# EAGLE design Left_Bar (EAGLE 9.1.1)
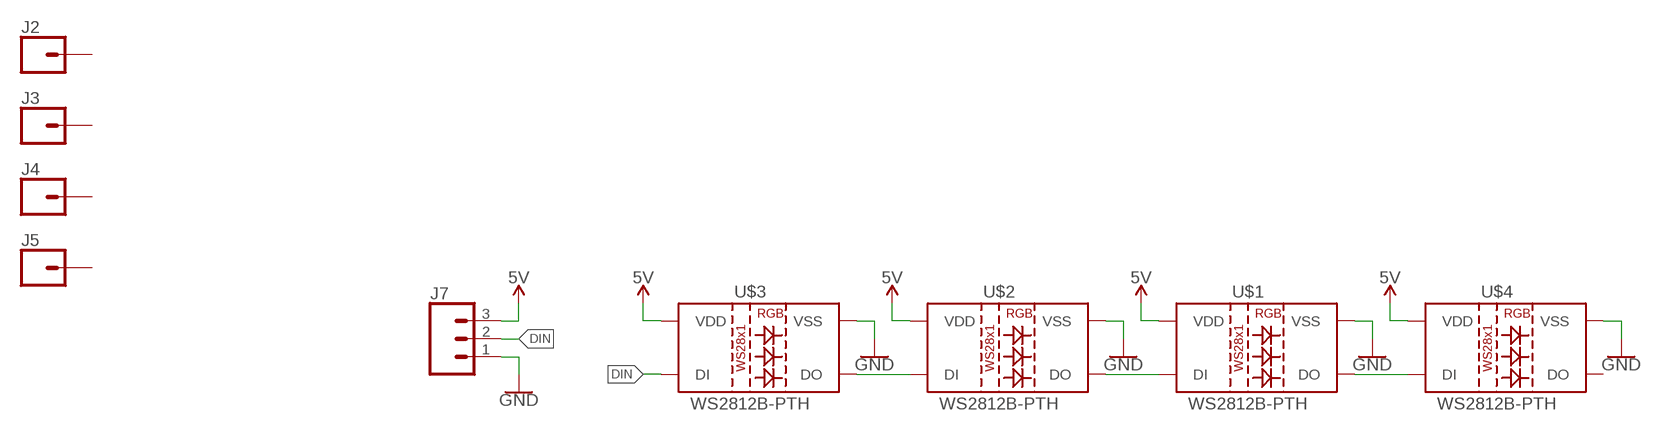
[diagram p0: schematic, sheet 1]

## Parts
J2  CONN_01OFFSET  [1X01_OFFSET]
J3  CONN_01OFFSET  [1X01_OFFSET]
J4  CONN_01OFFSET  [1X01_OFFSET]
J5  CONN_01OFFSET  [1X01_OFFSET]
J7  CONN_03  [1X03]
U$1  WS2812B-PTH  [WS2812B-PTH-KIT]
U$2  WS2812B-PTH  [WS2812B-PTH-KIT]
U$3  WS2812B-PTH  [WS2812B-PTH-KIT]
U$4  WS2812B-PTH  [WS2812B-PTH-KIT]

## Nets
5V: J7.3 U$1.2(VDD) U$2.2(VDD) U$3.2(VDD) U$4.2(VDD)
DIN: J7.2 U$3.1(DI)
GND: J7.1 U$1.3(VSS) U$2.3(VSS) U$3.3(VSS) U$4.3(VSS)
N$1: U$1.4(DO) U$4.1(DI)
N$7: U$2.1(DI) U$3.4(DO)
N$8: U$1.1(DI) U$2.4(DO)
Unconnected: J2.1 J3.1 J4.1 J5.1 U$4.4(DO)

## Library data of the parts
J2-J5 = SparkFun-Connectors:CONN_01: Single connection point. Often used as Generic Header-pin footprint for 0.1 inch spaced/style header connections On any of the 0.1 inch spaced packages, you can populate with these: Break Away Headers - Straight <https://www.sparkfun.com/products/116> (PRT-00116) Break Away Male Headers - Right Angle <https://www.sparkfun.com/products/553> (PRT-00553) Female Headers <https://www.sparkfun.com/products/115> (PRT-00115) Break Away Headers - Machine Pin <https://www.sparkfun.com/products/117> (PRT-00117) Break Away Female Headers - Swiss Machine Pin <https://www.sparkfun.com/products/743> (PRT-00743) This device is also useful as a general connection point to wire up your design to another part of your project. Our various solder wires solder well into these plated through hole pads. Hook-Up Wire - Assortment (Stranded, 22 AWG) <https://www.sparkfun.com/products/11375> (PRT-11375) Hook-Up Wire - Assortment (Solid Core, 22 AWG) <https://www.sparkfun.com/products/11367> (PRT-11367) View the entire wire category on our website here <https://www.sparkfun.com/categories/141> Special notes: SMTSO-256-ET is a "flush mount" nut for a 4-40 screw. We mostly use this on specialty testbeds; it is a nice way to connect hardware to your PCB at an adjustable hieght. Also note, the SNAP packages are for using a snappable style connector. We sell a baggie of snaps and they are also used on two LilyPad designs: Snap Assortment - 30 pack (male and female) <https://www.sparkfun.com/products/11347> (DEV-11347) LilyPad Arduino SimpleSnap <https://www.sparkfun.com/products/10941> (DEV-10941) LilyPad SimpleSnap Protoboard <https://www.sparkfun.com/products/10940> (DEV-10940)
J7 = SparkFun-Connectors:CONN_03: Multi connection point. Often used as Generic Header-pin footprint for 0.1 inch spaced/style header connections On any of the 0.1 inch spaced packages, you can populate with these: Break Away Headers - Straight <https://www.sparkfun.com/products/116> (PRT-00116) Break Away Male Headers - Right Angle <https://www.sparkfun.com/products/553> (PRT-00553) Female Headers <https://www.sparkfun.com/products/115> (PRT-00115) Break Away Headers - Machine Pin <https://www.sparkfun.com/products/117> (PRT-00117) Break Away Female Headers - Swiss Machine Pin <https://www.sparkfun.com/products/743> (PRT-00743) Stackable Header - 3 Pin (Female, 0.1") <https://www.sparkfun.com/products/13875> (PRT-13875) For SCREWTERMINALS and SPRING TERMINALS visit here: Screw Terimnals on SparkFun.com <https://www.sparkfun.com/search/results?term=Screw+Terminals> (5mm/3.5mm/2.54mm spacing) This device is also useful as a general connection point to wire up your design to another part of your project. Our various solder wires solder well into these plated through hole pads. Hook-Up Wire - Assortment (Stranded, 22 AWG) <https://www.sparkfun.com/products/11375> (PRT-11375) Hook-Up Wire - Assortment (Solid Core, 22 AWG) <https://www.sparkfun.com/products/11367> (PRT-11367) View the entire wire category on our website here <https://www.sparkfun.com/categories/141> Special notes: Molex polarized connector foot print use with SKU : PRT-08232 with associated crimp pins and housings.; PROD_ID: XXX-00000; VALUE: 455-1750-1-ND
U$1-U$4 = SparkFun-LED:WS2812B-PTH: WS2812B PTH addressable RGB LED 5mm PTH LED with built-in controller IC. Color: Red/Green/Blue mC Rating: RGB: 390, 660, 180 mcd Forward Voltage: RGB: 2.0, 3.0, 3.0 V SparkFun Products: LED - RGB Addressable, PTH, 5mm Diffused (5 Pack) <https://www.sparkfun.com/products/12986> LED - RGB Addressable, PTH, 5mm Clear (5 Pack) <https://www.sparkfun.com/products/12999> Datasheet referenced for footprint: WS2812B-PTH <https://cdn.sparkfun.com/datasheets/Components/LED/COM-12877.pdf>

## Board
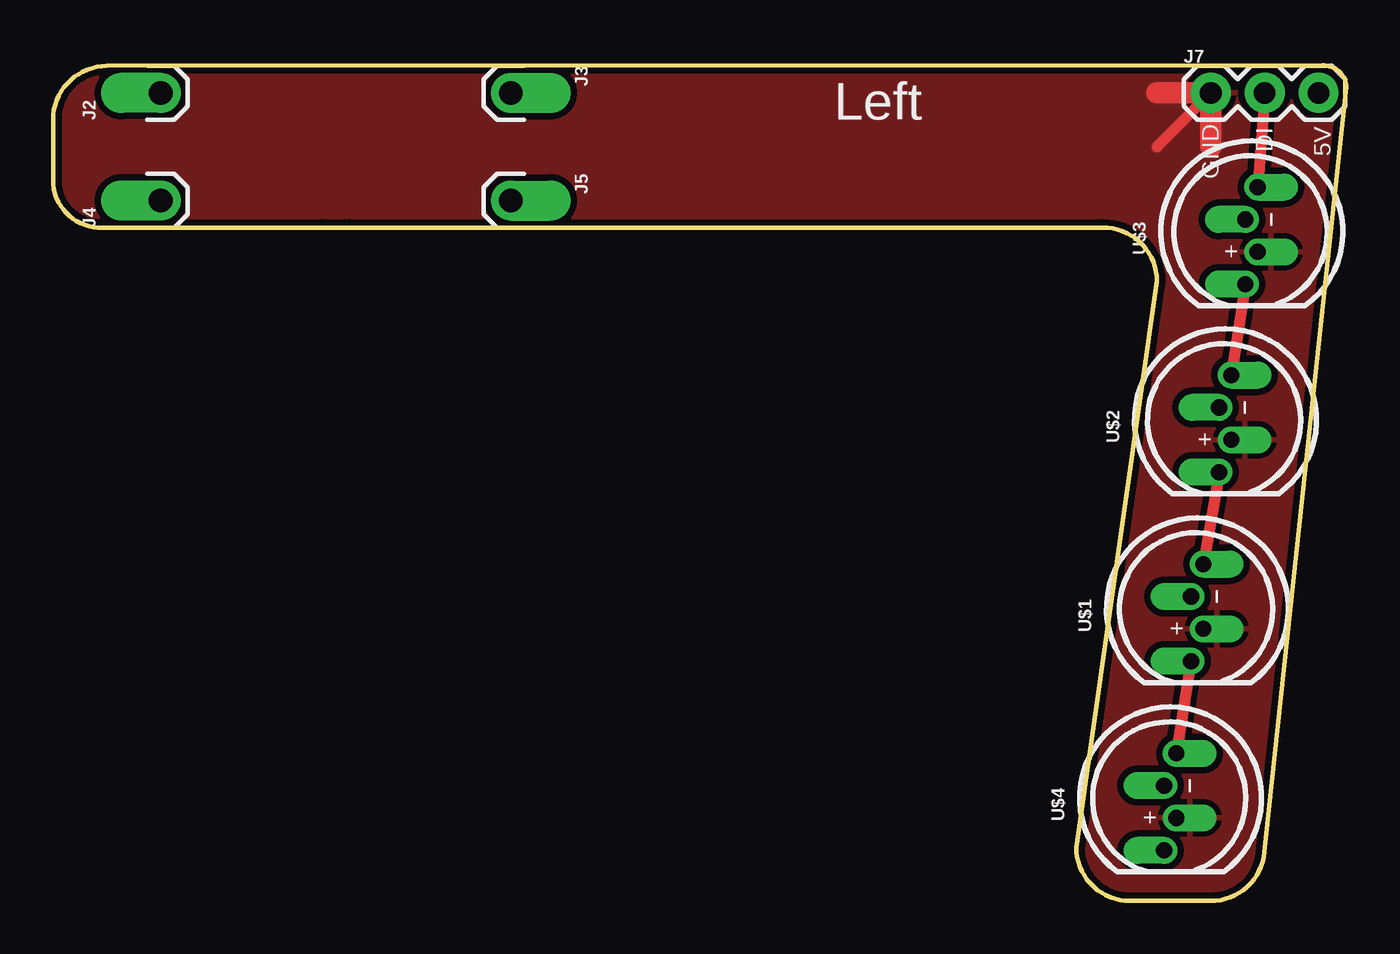
[diagram p1: board, top side]
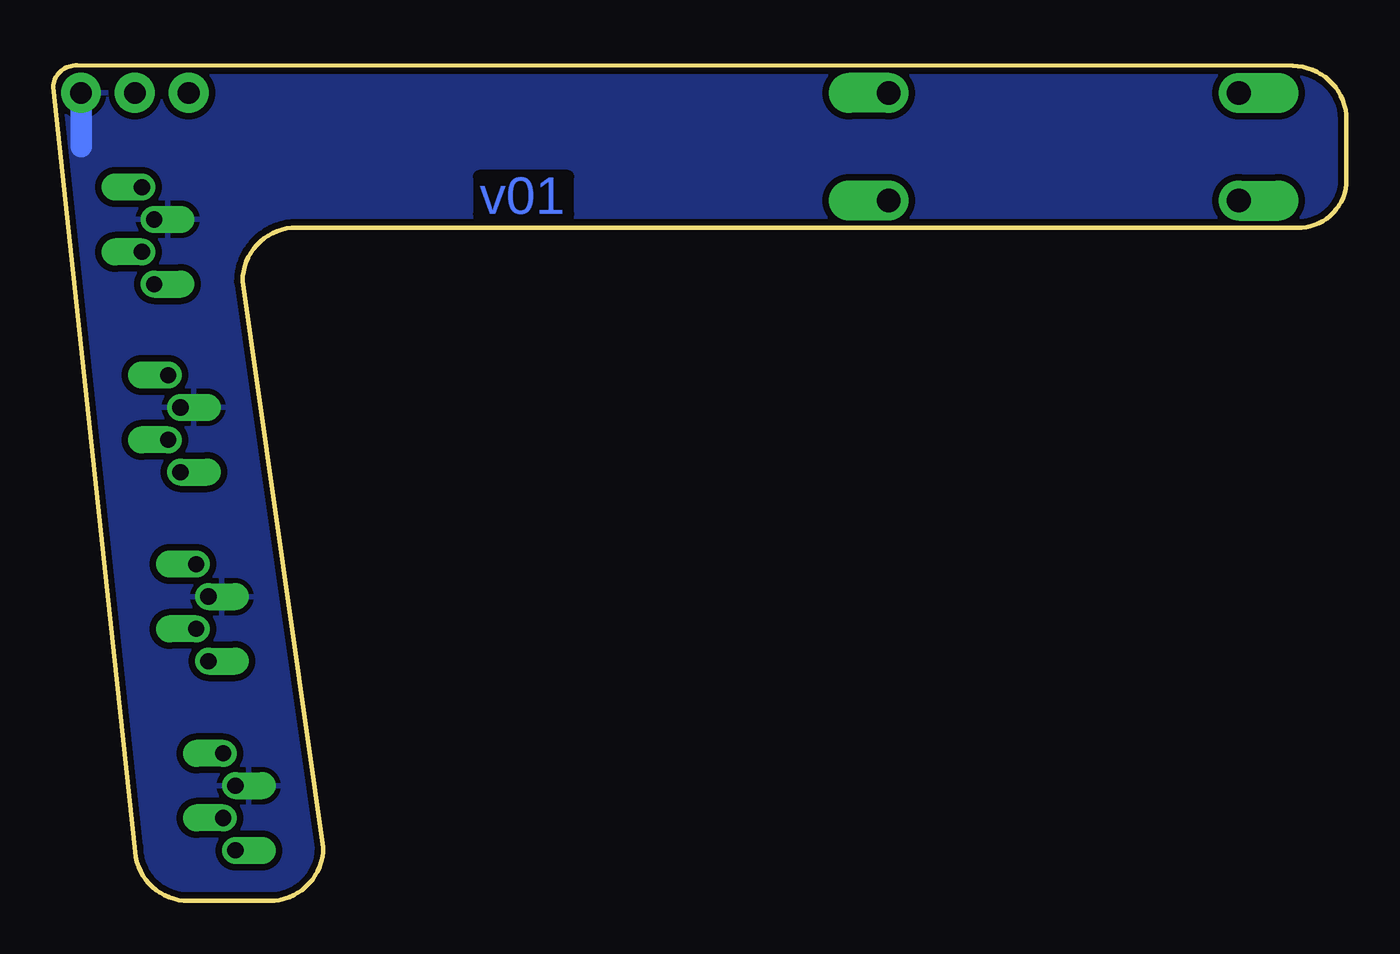
[diagram p2: board, bottom side, seen from below]

Size 61.01 x 39.4 mm. Coordinates in mm from the lower left corner, seen from the top.
Outline: 0,36.83 0,33.78 arc90 2.54,31.75 12.7,31.75 13.97,31.75 49.53,31.75 arc-90 52.07,29.21 48.26,2.54 arc90 50.8,0 54.61,0 arc90 57.15,2.54 61.01,38.35 arc90 59.87,39.4 2.54,39.37 arc90 0,36.83
Copper layers (1*16): Top 0.035mm / dielectric 1.5mm / Bottom 0.035mm
Design rules "SparkFun-2-layer-STANDARD": minimum track width 10mil, minimum drill 20mil, track to track 10mil, track to pad 8mil, pad to pad 8mil, via to via 10mil, smd to smd 8mil, copper to edge 8mil, drill to drill 8mil, minimum pad ring 10mil, minimum via ring 10mil, stop-mask expansion 4mil, vias tented up to drill 25mil, thermal gap 10mil

### Footprints (pad centres in the part's own frame; a part is rotated, then mirrored left to right if it is on the bottom)
1X01_OFFSET = drill 1.118 pad 1.88 offset: 1 0,0
1X03 = drill 1.016 pad 1.88: 1 0,0; 2 2.54,0; 3 5.08,0
WS2812B-PTH-KIT = drill 0.762 pad 1.27 offset: 1 2.413,0.079; 2 0.889,0.651; 3 -0.635,0.079; 4 -2.159,0.651

### Placement (x,y rotation side)
J2  5.08,38.1 90 top
J3  21.59,38.1 270 top
J4  5.08,33.02 90 top
J5  21.59,33.02 270 top
J7  54.61,38.1 0 top
U$1  54.33,13.46 90 top
U$2  55.65,22.38 90 top
U$3  56.9,31.24 90 top
U$4  53.06,4.55 90 top

### Tracks (layer width: path | path; a pad name or v marks a point on that pad's centre or on a via)
5V
  Bottom 1.016: J7.3 59.69,35.56
  pour Bottom (isolate 0.305): 0,0 0,39.37 60.96,39.37 60.96,0
DIN
  Top 0.508: J7.2 U$3.1
GND  (via drill 0.51)
  Top 0.508: J7.1 52.07,35.56
  Top 1.016: 54.61,35.56 J7.1 52.07,38.1
  other vias: 54.61,38.1
  pour Top (isolate 0.305): 0,0 60.96,0 60.96,39.37 0,39.37
N$1
  Top 0.508: U$1.4 U$4.1
N$7
  Top 0.508: U$3.4 U$2.1
N$8
  Top 0.508: U$2.4 U$1.1

### Text on the board
Bottom: v01
tPlace: Left | GND | 5V | DI